# Altium schematic sheet Diff.SchDoc: Наименование
size 420 x 297 mm; ApprovedBy: Сидоров; CheckedBy: Петров; Author: Иванов; CompanyName: РГППУ; Title2str: Изделия; DecimalNumber: АБВГ.123456.001 33
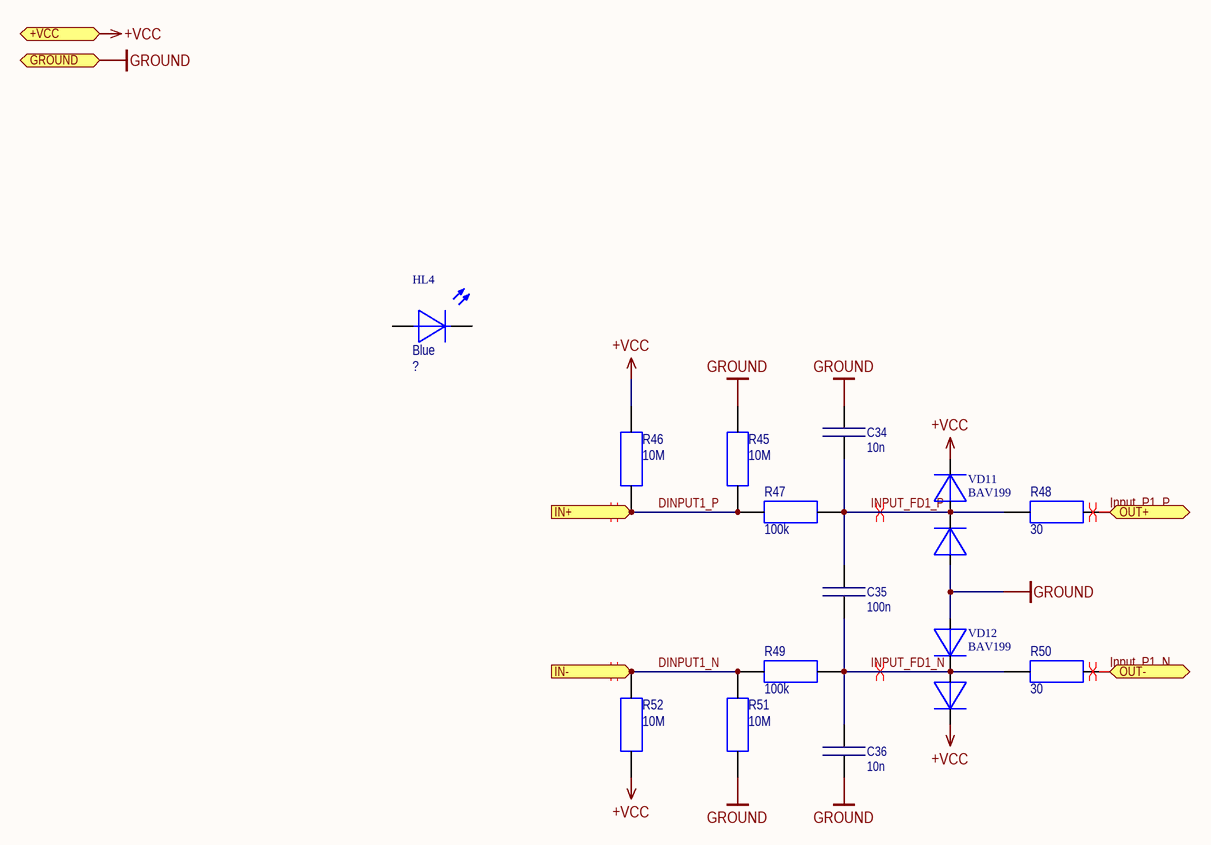
[diagram p0: Diff.SchDoc]

## Parts
C34  10n  [SMDRC0805]
C35  100n  [SMDRC0805]
C36  10n  [SMDRC0805]
HL4  Blue  [DIOMELF2012M]
R45  10M  [SMDRC0805]
R46  10M  [SMDRC0805]
R47  100k  [SMDRC0805]
R48  30  [SMDRC0805]
R49  100k  [SMDRC0805]
R50  30  [SMDRC0805]
R51  10M  [SMDRC0805]
R52  10M  [SMDRC0805]
VD11  BAV199  [SOT23 (TO-236AB)]
VD12  BAV199  [SOT23 (TO-236AB)]

## Ports
+VCC (in), GROUND (in), IN+ (in), IN- (in), OUT+ (out), OUT- (out)

## Nets
+VCC: R46.2 R52.1 VD11.2 VD12.2 ; port +VCC
GROUND: C34.2 C36.1 R45.2 R51.1 VD11.1 VD12.1 ; port GROUND
DINPUT1_N: R49.1 R51.2 R52.2 ; port IN-
DINPUT1_P: R45.1 R46.1 R47.1 ; port IN+
INPUT_FD1_N: C35.1 C36.2 R49.2 R50.1 VD12.3
INPUT_FD1_P: C34.1 C35.2 R47.2 R48.1 VD11.3
Input_P1_N: R50.2 ; port OUT-
Input_P1_P: R48.2 ; port OUT+

Not connected (* = marked no-connect by the designer): HL4 1 2

## Layout directives
differential pair: DINPUT1_N, DINPUT1_P, INPUT_FD1_N, INPUT_FD1_P, Input_P1_N, Input_P1_P

## Notes on the sheet
- Изм.
- Лист
- N*докум.
- Подп.
- Дата
- Лит.
- Масса
- Масштаб
- Разраб.
- Пров.
- Т.контр.
- Лиcт
- Лиcтов
- Н.контр.
- Утв.

## Library data of the parts
C34 C36 = Capacitor 0805 10n: Generic capasitor non-polar; PartNumber: Capacitor 0805 10n; Value: 10n; ComponentLink1Description: Datasheet; Package: 0805
C35 = Capacitor 0805 100n: Generic capasitor non-polar; PartNumber: Capacitor 0805 100n; Value: 100n; ComponentLink1Description: Datasheet; Package: 0805
HL4 = LED1_B: Diod LED SMD Blue; ComponentLink1Description: Datasheet; ComponentLink2Description: Datasheet-local; ComponentLink2URL: *; Color: Blue; ManufacturerPartNumber: ?
R45 R46 R51 R52 = Resistor 0805 10M: Generic resistor; PartNumber: Resistor 0805 10M; Value: 10M; ComponentLink1URL: http://www.mouser.com/ds/2/447/PYu-RC0402_51_RoHS_L_6_r-8721.pdf; ComponentLink1Description: Datasheet; Package: 0805
R47 R49 = Resistor 0805 100k: Generic resistor; PartNumber: Resistor 0805 100k; Value: 100k; ComponentLink1URL: http://www.mouser.com/ds/2/447/PYu-RC0402_51_RoHS_L_6_r-8721.pdf; ComponentLink1Description: Datasheet; Package: 0805
R48 R50 = Resistor 0805 30: Generic resistor; PartNumber: Resistor 0805 30; Value: 30; ComponentLink1URL: http://www.mouser.com/ds/2/447/PYu-RC0402_51_RoHS_L_6_r-8721.pdf; ComponentLink1Description: Datasheet; Package: 0805
VD11 VD12 = BAV199: Epitaxial, medium-speed switching,  double diode in a small SOT23 plastic  SMD package. The diodes are  connected in series.; Manufacturer: NXP; ManufacturerPartNumber: BAV199; Cost: 0.73; ComponentLink1Description: Datasheet; Package: SOT23; Supplier: Промэлектроника; ComponentLink1URL: http://www.nxp.com/documents/data_sheet/BAV199.pdf